# EAGLE design fpc-40-breakout (EAGLE 9.3.0)
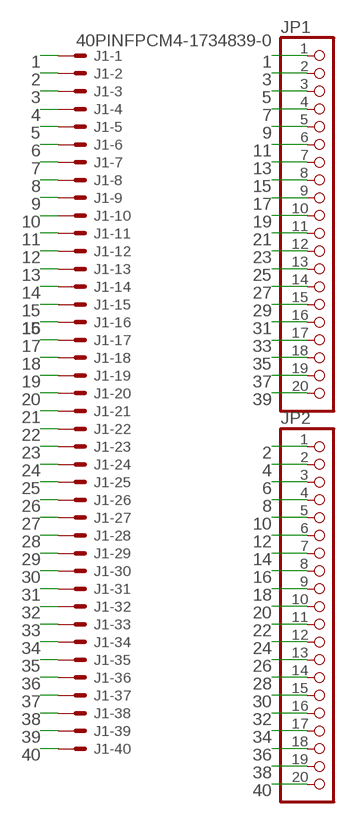
[diagram p0: schematic, sheet 1]

## Parts
J1  40PINFPCM4-1734839-0  [4-1734839-0]
JP1  PINHD-1X20/90  [1X20/90]
JP2  PINHD-1X20/90  [1X20/90]

## Nets
1: J1.1 JP1.1
2: J1.2 JP2.1
3: J1.3 JP1.2
4: J1.4 JP2.2
5: J1.5 JP1.3
6: J1.6 JP2.3
7: J1.7 JP1.4
8: J1.8 JP2.4
9: J1.9 JP1.5
10: J1.10 JP2.5
11: J1.11 JP1.6
12: J1.12 JP2.6
13: J1.13 JP1.7
14: J1.14 JP2.7
15: J1.15 JP1.8
16: J1.16 JP2.8
17: J1.17 JP1.9
18: J1.18 JP2.9
19: J1.19 JP1.10
20: J1.20 JP2.10
21: J1.21 JP1.11
22: J1.22 JP2.11
23: J1.23 JP1.12
24: J1.24 JP2.12
25: J1.25 JP1.13
26: J1.26 JP2.13
27: J1.27 JP1.14
28: J1.28 JP2.14
29: J1.29 JP1.15
30: J1.30 JP2.15
31: J1.31 JP1.16
32: J1.32 JP2.16
33: J1.33 JP1.17
34: J1.34 JP2.17
35: J1.35 JP1.18
36: J1.36 JP2.18
37: J1.37 JP1.19
38: J1.38 JP2.19
39: J1.39 JP1.20
40: J1.40 JP2.20

## Library data of the parts
J1 = adafruit:40PINFPC: OMRON FPC Connector Source : http://www.omron.com/ecb/products/pdf/fpc.pdf XF2M-4015-rev is good for connecting up 'PSP' SHARP LQ043 LCDs
JP1 JP2 = pinhead:PINHD-1X20: PIN HEADER

## Board
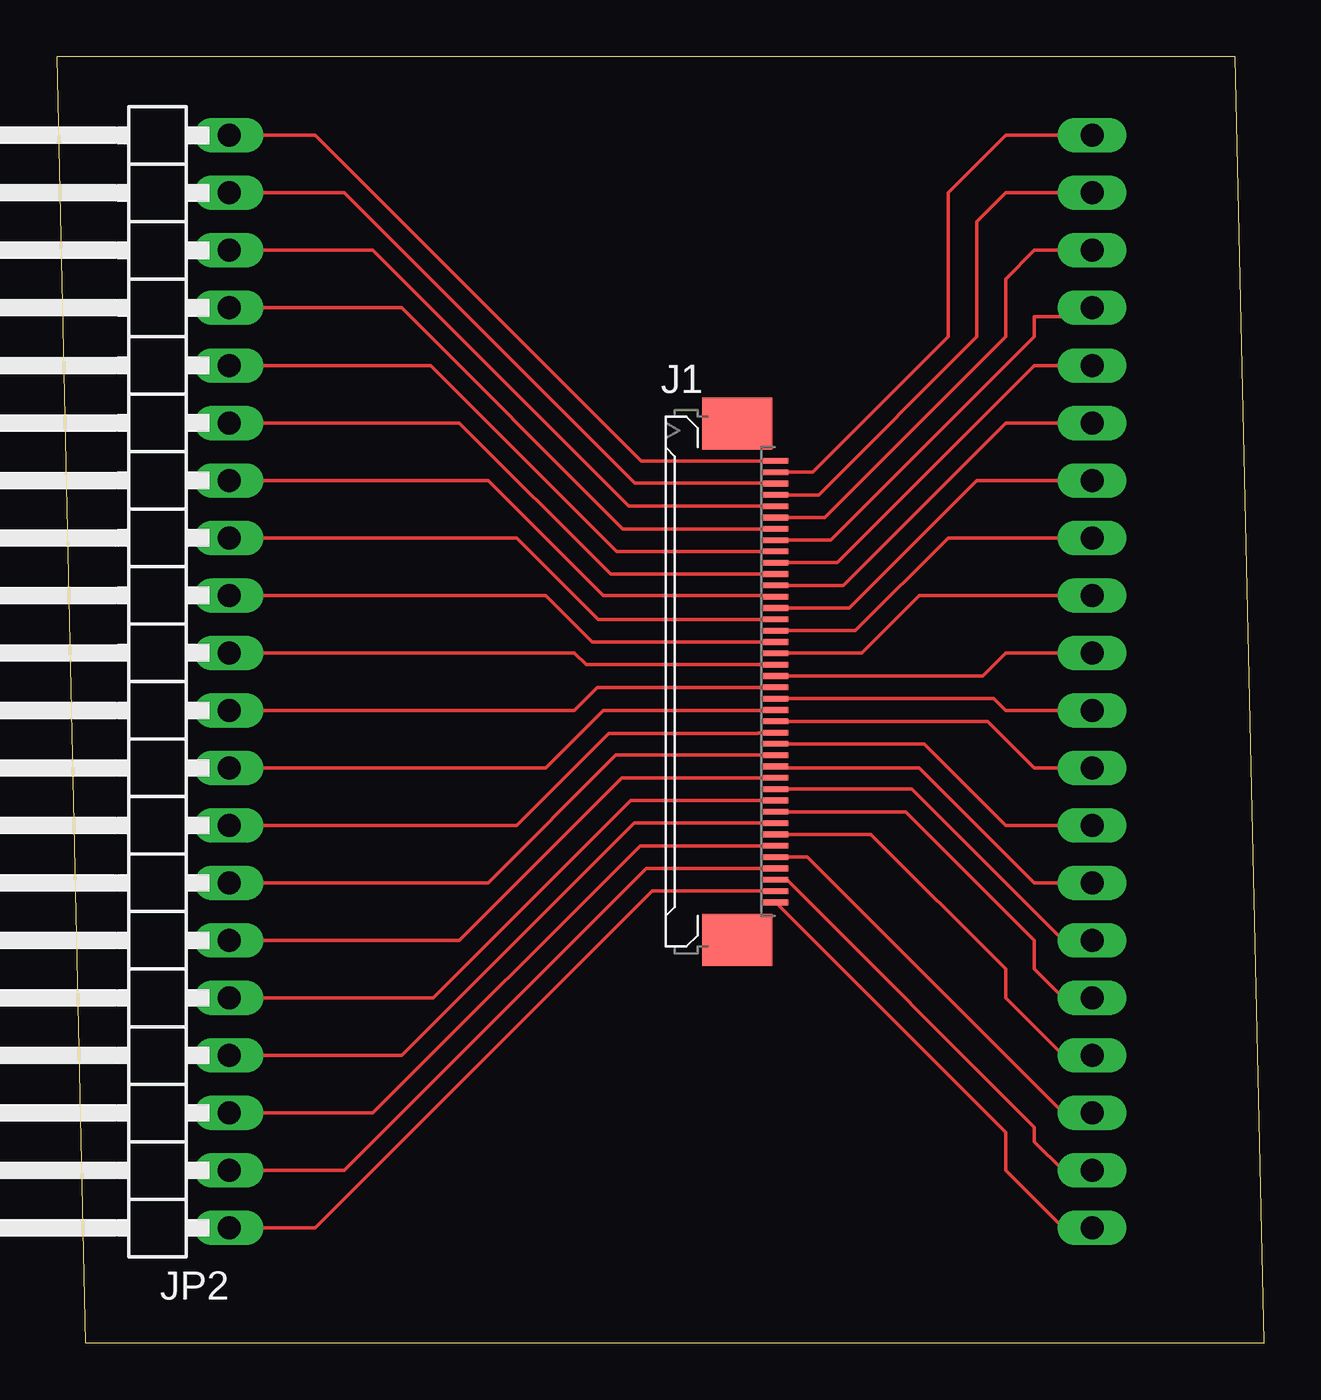
[diagram p1: board, top side]
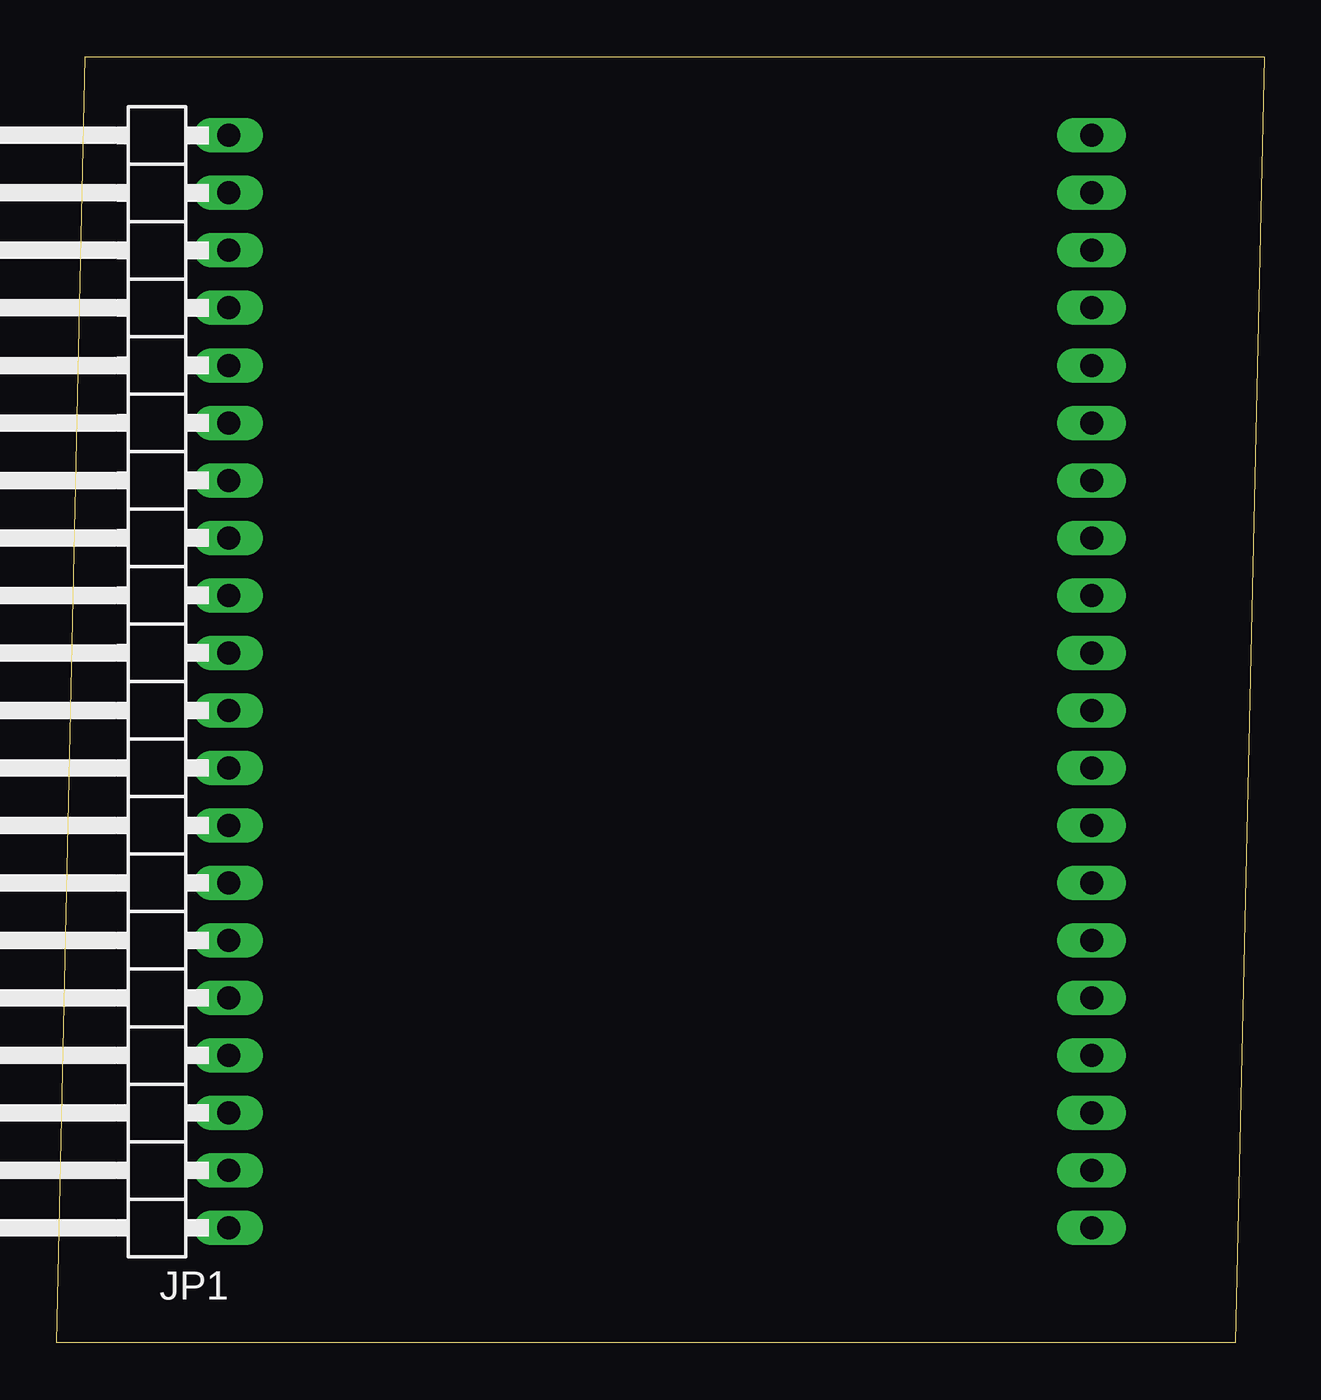
[diagram p2: board, bottom side, seen from below]

Size 53.32 x 56.82 mm. Coordinates in mm from the lower left corner, seen from the top.
Outline: 1.27,0 53.32,0 52.05,56.82 0,56.82 1.27,0
Copper layers (1*16): Top 0.035mm / dielectric 1.5mm / Bottom 0.035mm
Design rules "default": minimum track width 6mil, minimum drill 0.35mm, track to track 6mil, track to pad 6mil, pad to pad 6mil, via to via 6mil, smd to smd 6mil, copper to edge 40mil, drill to drill 6mil, minimum pad ring 10mil, minimum via ring 8mil, stop-mask expansion 4mil, vias tented up to drill 0mil, thermal gap 10mil

### Footprints (pad centres in the part's own frame; a part is rotated, then mirrored left to right if it is on the bottom)
4-1734839-0 = smd 0.25 x 1.1: 1 -9.75,-2.54; 2 -9.25,-2.54; 3 -8.75,-2.54; 4 -8.25,-2.54; 5 -7.75,-2.54; 6 -7.25,-2.54; 7 -6.75,-2.54; 8 -6.25,-2.54; 9 -5.75,-2.54; 10 -5.25,-2.54; 11 -4.75,-2.54; 12 -4.25,-2.54; 13 -3.75,-2.54; 14 -3.25,-2.54; 15 -2.75,-2.54; 16 -2.25,-2.54; 17 -1.75,-2.54; 18 -1.25,-2.54; 19 -0.75,-2.54; 20 -0.25,-2.54; 21 0.25,-2.54; 22 0.75,-2.54; 23 1.25,-2.54; 24 1.75,-2.54; 25 2.25,-2.54; 26 2.75,-2.54; 27 3.25,-2.54; 28 3.75,-2.54; 29 4.25,-2.54; 30 4.75,-2.54; 31 5.25,-2.54; 32 5.75,-2.54; 33 6.25,-2.54; 34 6.75,-2.54; 35 7.25,-2.54; 36 7.75,-2.54; 37 8.25,-2.54; 38 8.75,-2.54; 39 9.25,-2.54; 40 9.75,-2.54 | smd 2.3 x 3.1: M1 11.4,-0.84; M2 -11.4,-0.84
1X20/90 = drill 1.016 long: 1 -24.13,-3.81; 2 -21.59,-3.81; 3 -19.05,-3.81; 4 -16.51,-3.81; 5 -13.97,-3.81; 6 -11.43,-3.81; 7 -8.89,-3.81; 8 -6.35,-3.81; 9 -3.81,-3.81; 10 -1.27,-3.81; 11 1.27,-3.81; 12 3.81,-3.81; 13 6.35,-3.81; 14 8.89,-3.81; 15 11.43,-3.81; 16 13.97,-3.81; 17 16.51,-3.81; 18 19.05,-3.81; 19 21.59,-3.81; 20 24.13,-3.81

### Placement (x,y rotation side)
J1  29.21,29.21 90 top
JP1  49.53,29.21 90 bottom
JP2  3.81,29.21 90 top

### Tracks (layer width: path | path; a pad name or v marks a point on that pad's centre or on a via)
1
  Top 0.152: J1.1 41.91,9.3 41.91,7.62 44.45,5.08 JP1.1
2
  Top 0.152: J1.2 26.31,19.96 11.43,5.08 JP2.1
3
  Top 0.152: J1.3 31.77,20.44 32.27,20.44 43.18,9.53 43.18,8.89 44.45,7.62 JP1.2
4
  Top 0.152: J1.4 26.04,20.96 12.7,7.62 JP2.2
5
  Top 0.152: J1.5 33.15,21.46 44.45,10.16 JP1.3
6
  Top 0.152: J1.6 25.77,21.96 13.97,10.16 JP2.3
7
  Top 0.152: J1.7 35.96,22.46 41.91,16.51 41.91,15.24 44.45,12.7 JP1.4
8
  Top 0.152: J1.8 25.5,22.96 15.24,12.7 JP2.4
9
  Top 0.152: J1.9 37.5,23.46 43.18,17.78 43.18,16.51 44.45,15.24 JP1.5
10
  Top 0.152: J1.10 25.36,23.96 16.64,15.24 JP2.5
11
  Top 0.152: J1.11 37.77,24.46 44.45,17.78 JP1.6
12
  Top 0.152: J1.12 24.96,24.96 17.78,17.78 JP2.6
13
  Top 0.152: J1.13 31.81,25.4 38.1,25.4 43.18,20.32 JP1.7
14
  Top 0.152: J1.14 24.69,25.96 19.05,20.32 JP2.7
15
  Top 0.152: J1.15 38.31,26.46 41.91,22.86 JP1.8
16
  Top 0.152: J1.16 31.73,26.94 30.98,26.94 30.96,26.92 24.38,26.92 20.32,22.86 JP2.8
17
  Top 0.152: J1.17 41.12,27.46 43.18,25.4 JP1.9
18
  Top 0.152: J1.18 31.73,27.94 24.13,27.94 21.59,25.4 JP2.9
19
  Top 0.152: J1.19 41.39,28.46 41.91,27.94 JP1.10
20
  Top 0.152: J1.20 23.88,28.96 22.86,27.94 JP2.10
21
  Top 0.152: J1.21 40.89,29.46 41.91,30.48 JP1.11
22
  Top 0.152: J1.22 23.38,29.96 22.86,30.48 JP2.11
23
  Top 0.152: J1.23 31.77,30.48 35.56,30.48 38.1,33.02 JP1.12
24
  Top 0.152: J1.24 23.65,30.96 21.59,33.02 JP2.12
25
  Top 0.152: J1.25 35.27,31.46 39.37,35.56 JP1.13
26
  Top 0.152: J1.26 23.92,31.96 20.32,35.56 JP2.13
27
  Top 0.152: J1.27 35,32.46 40.64,38.1 JP1.14
28
  Top 0.152: J1.28 31.69,33.02 24.13,33.02 19.05,38.1 JP2.14
29
  Top 0.152: J1.29 34.73,33.46 41.91,40.64 JP1.15
30
  Top 0.152: J1.30 24.46,33.96 17.78,40.64 JP2.15
31
  Top 0.152: J1.31 34.46,34.46 43.18,43.18 JP1.16
32
  Top 0.152: J1.32 24.73,34.96 16.51,43.18 JP2.16
33
  Top 0.152: J1.33 34.19,35.46 43.18,44.45 43.18,45.34 45.34,45.34 JP1.17
34
  Top 0.152: J1.34 25,35.96 15.24,45.72 JP2.17
35
  Top 0.152: J1.35 33.92,36.46 41.91,44.45 41.91,46.99 43.18,48.26 JP1.18
36
  Top 0.152: J1.36 25.27,36.96 13.97,48.26 JP2.18
37
  Top 0.152: J1.37 33.65,37.46 40.64,44.45 40.64,49.53 41.91,50.8 JP1.19
38
  Top 0.152: J1.38 31.74,37.97 25.53,37.97 12.7,50.8 JP2.19
39
  Top 0.152: J1.39 33.38,38.46 39.37,44.45 39.37,50.8 41.91,53.34 JP1.20
40
  Top 0.152: J1.40 25.81,38.96 11.43,53.34 JP2.20